# EAGLE design ir-sensor-breakout-drill-template-mk-1.0 (EAGLE 6.5.0)
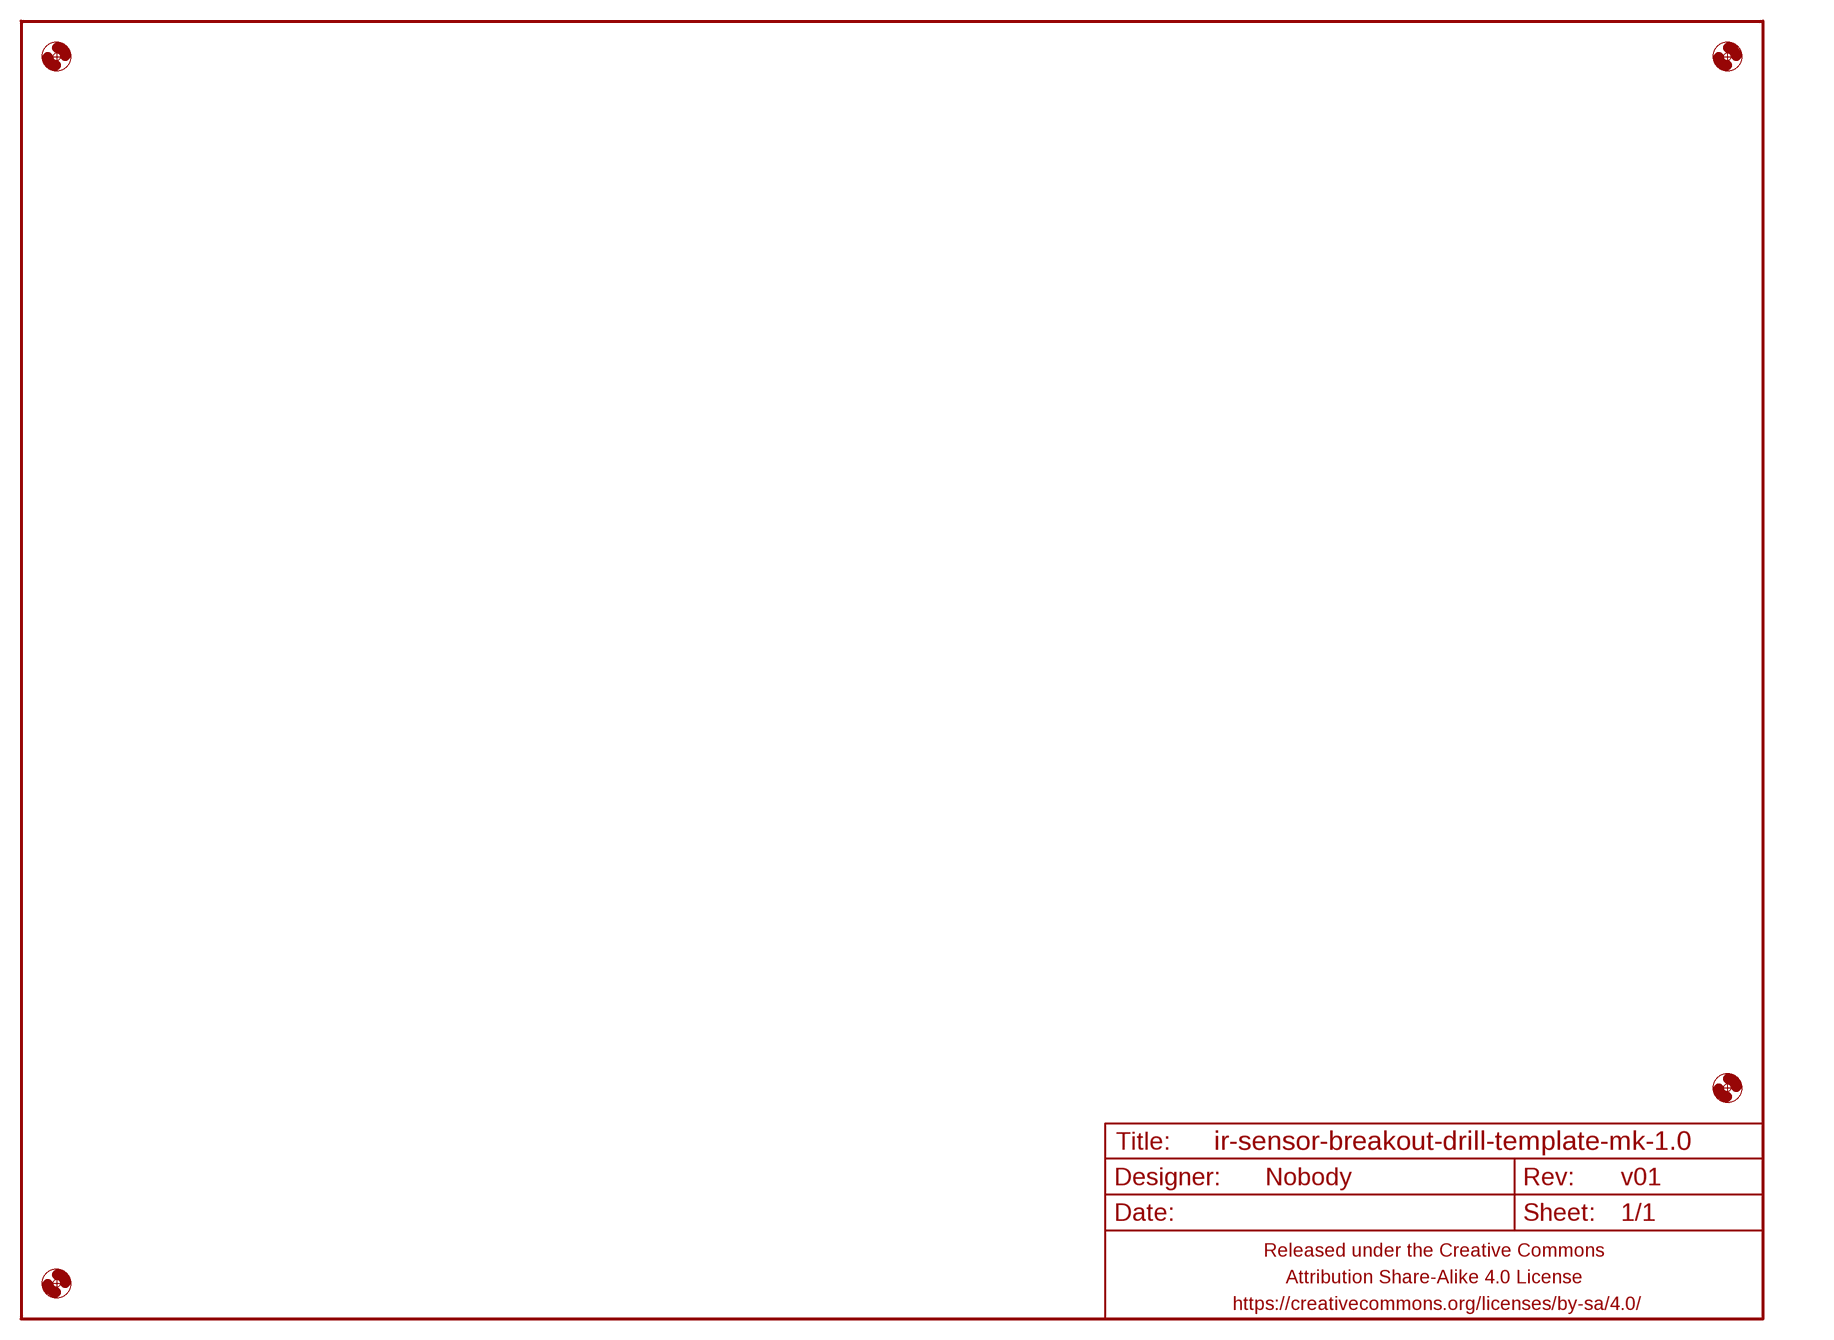
[diagram p0: schematic, sheet 1]

## Parts
FRAME1  FRAME-LETTERNO_PACKAGE  [DUMMY]
H1  HOLE#2  [HOLE-#2]
H2  HOLE#2  [HOLE-#2]
H3  HOLE#2  [HOLE-#2]
H4  HOLE#2  [HOLE-#2]

## Library data of the parts
FRAME1 = A_butts:FRAME-LETTER: Schematic Frame Standard 8.5x11 US Letter frame; DESIGNER: Nobody; VERSION: v01
H1-H4 = A_butts:HOLE: MOUNTING HOLE with drill center marker

## Board
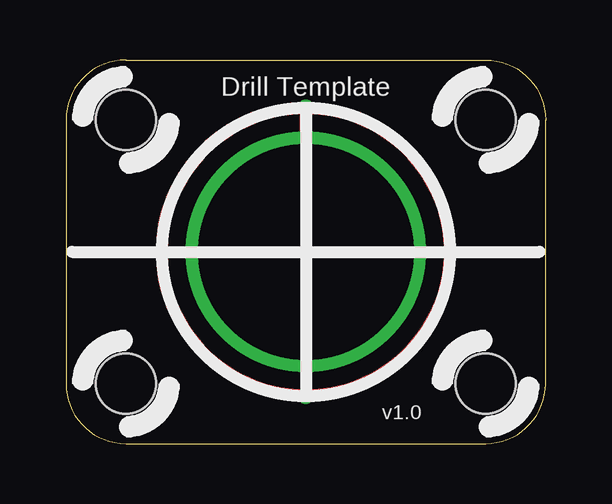
[diagram p1: board, top side]
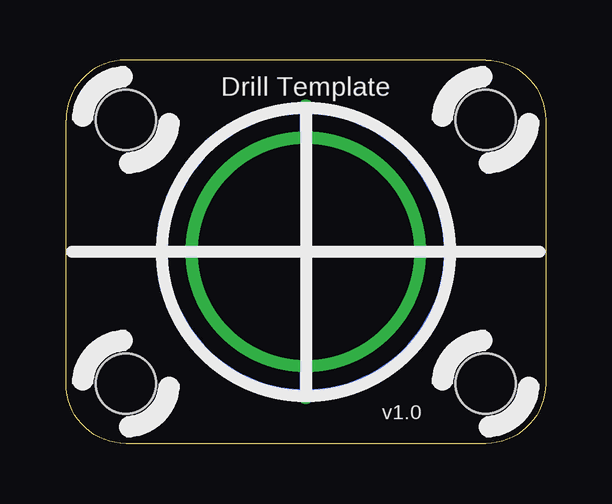
[diagram p2: board, bottom side, seen from below]

Size 20 x 16 mm. Coordinates in mm from the lower left corner, seen from the top.
Outline: 2.5,16 17.5,16 arc-90 20,13.5 20,2.5 arc-90 17.5,0 2.5,0 arc-90 0,2.5 0,13.5 arc-90 2.5,16
Copper layers (1*16): Top 0.0356mm / dielectric 1.5011mm / Bottom 0.0356mm
Design rules "LaenPCBOrder_2": minimum track width 6mil, minimum drill 13mil, track to track 6mil, track to pad 6mil, pad to pad 6mil, via to via 6mil, smd to smd 6mil, copper to edge 15mil, drill to drill 6mil, minimum pad ring 7mil, minimum via ring 7mil, stop-mask expansion 3mil, vias tented up to drill 20mil, thermal gap 10mil

### Footprints (pad centres in the part's own frame; a part is rotated, then mirrored left to right if it is on the bottom)
HOLE-#2 = hole 2.5: 0,0

### Placement (x,y rotation side)
FRAME1  0,0 0 top
H1  2.5,2.5 0 top
H2  2.5,13.5 0 top
H3  17.5,13.5 0 top
H4  17.5,2.5 0 top

### Tracks (layer width: path | path; a pad name or v marks a point on that pad's centre or on a via)
GND  (via drill 0.33, 9)
  Top 0.5: v10,8 v10,2 | 0.25,8 v4,8 | v4,8 v10,8 | v16,8 19.75,8 | v10,8 v10,14 | v10,8 v16,8 | v4,8 arc-90 v10,14 | v10,14 arc-90 v16,8 | v16,8 arc-90 v10,2 | v10,2 arc-90 v4,8
  Bottom 0.5: 0.25,8 v4,8 | v4,8 v16,8 | v16,8 19.75,8 | v10,2 v10,14 | v4,8 arc90 v10,2 | v10,2 arc90 v16,8 | v16,8 arc90 v10,14 | v10,14 arc90 v4,8

### Text on the board
tPlace: Drill Template
bPlace: Drill Template